# EAGLE schematic BatteryBoardV2B (EAGLE 8.2.2)
EquiSat Battery Charging

## Sheet 1 of 6: Data and I/O
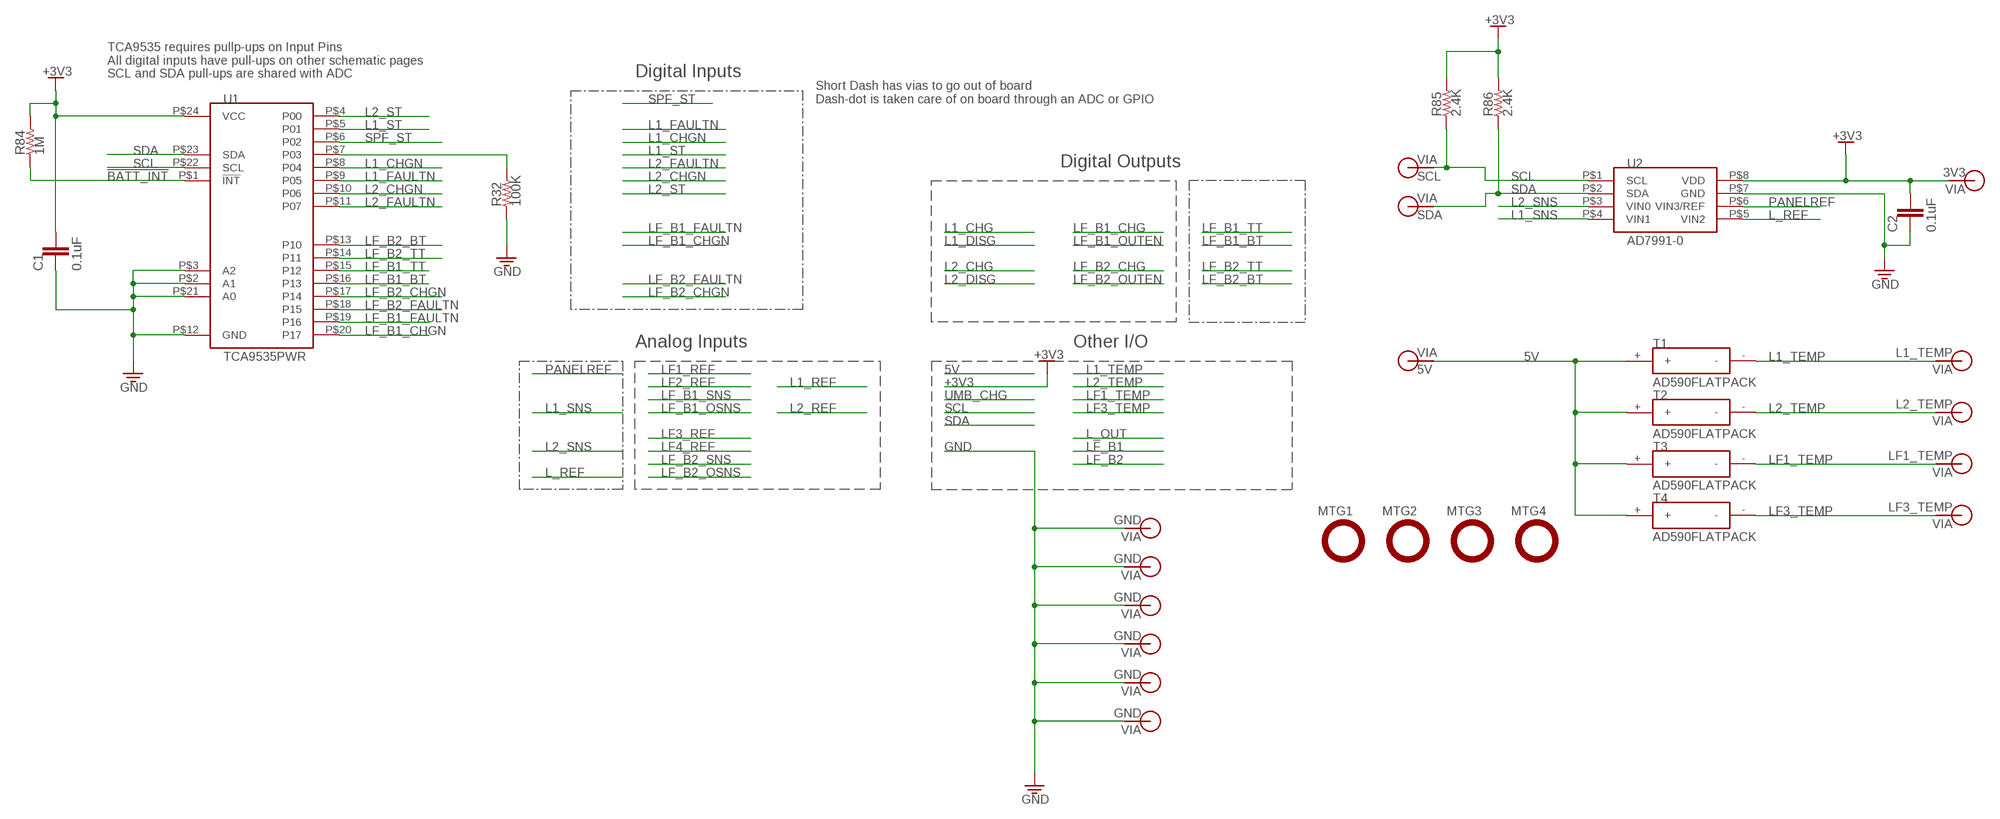
[diagram p0: schematic, sheet 1]

### Parts
C1  0.1uF  CAP0805  [0805]
C2  0.1uF  CAP0805  [0805]
MTG1  MTG-NPTH-#2-CLOSE  [#2-CLOSE-NPTH]
MTG2  MTG-NPTH-#2-CLOSE  [#2-CLOSE-NPTH]
MTG3  MTG-NPTH-#2-CLOSE  [#2-CLOSE-NPTH]
MTG4  MTG-NPTH-#2-CLOSE  [#2-CLOSE-NPTH]
R32  100K  RES0805  [0805]
R84  1M  RES0805  [0805]
R85  2.4K  RES0805  [0805]
R86  2.4K  RES0805  [0805]
T1  AD590FLATPACK  [FLATPACK]
T2  AD590FLATPACK  [FLATPACK]
T3  AD590FLATPACK  [FLATPACK]
T4  AD590FLATPACK  [FLATPACK]
U1  TCA9535PWR  [TSSOP-24]
U2  AD7991-0  [SOT-23-8]
V1  GND  VIA-120MIL  [VIA-120MIL]
V2  GND  VIA-120MIL  [VIA-120MIL]
V3  GND  VIA60MIL-SQ  [VIA-60MIL-SQ]
V4  GND  VIA-120MIL  [VIA-120MIL]
V5  SCL  VIA-60MIL  [VIA-60MIL]
V6  SDA  VIA-60MIL  [VIA-60MIL]
V7  5V  VIA-60MIL  [VIA-60MIL]
V8  L1_TEMP  VIA-60MIL  [VIA-60MIL]
V9  L2_TEMP  VIA-60MIL  [VIA-60MIL]
V10  LF1_TEMP  VIA-60MIL  [VIA-60MIL]
V11  LF3_TEMP  VIA-60MIL  [VIA-60MIL]
V12  3V3  VIA-60MIL  [VIA-60MIL]
V28  GND  VIA60MIL-SQ  [VIA-60MIL-SQ]
V36  GND  VIA60MIL-SQ  [VIA-60MIL-SQ]

### Nets
5V [Analog]: T1.+ T2.+ T3.+ T4.+ V7.P$1
!BATT_INT!: R84.1 U1.P$1(!INT!)
+3V3 [3V3]: C1.1 C2.1 R84.2 R85.2 R86.2 U1.P$24(VCC) U2.P$8(VDD) V12.P$1 ; also sheet 2,3,5,6
GND: C1.2 C2.2 R32.1 U1.P$2(A1) U1.P$3(A2) U1.P$12(GND) U1.P$21(A0) U2.P$7(GND) V1.P$1 V2.P$1 V3.P$1 V4.P$1 V28.P$1 V36.P$1 ; also sheet 2,3,4,5,6
L1_CHGN [Digital]: U1.P$8(P04) ; also sheet 3
L1_FAULTN [Digital]: U1.P$9(P05) ; also sheet 3
L1_SNS [Analog]: U2.P$4(VIN1) ; also sheet 3
L1_ST [Digital]: U1.P$5(P01) ; also sheet 4
L1_TEMP [Analog]: T1.- V8.P$1
L2_CHGN [Analog]: U1.P$10(P06) ; also sheet 3
L2_FAULTN [Digital]: U1.P$11(P07) ; also sheet 3
L2_SNS [Analog]: U2.P$3(VIN0) ; also sheet 3
L2_ST [Digital]: U1.P$4(P00) ; also sheet 4
L2_TEMP [Analog]: T2.- V9.P$1
L_REF [Analog]: U2.P$5(VIN2) ; also sheet 4
LF1_TEMP [Analog]: T3.- V10.P$1
LF3_TEMP [Analog]: T4.- V11.P$1
LF_B1_BT [Digital]: U1.P$16(P13)
LF_B1_CHGN [Digital]: U1.P$20(P17) ; also sheet 5
LF_B1_FAULTN [Digital]: U1.P$19(P16) ; also sheet 5
LF_B1_TT [Digital]: U1.P$15(P12)
LF_B2_BT [Digital]: U1.P$13(P10)
LF_B2_CHGN [Digital]: U1.P$17(P14) ; also sheet 6
LF_B2_FAULTN [Digital]: U1.P$18(P15) ; also sheet 6
LF_B2_TT [Digital]: U1.P$14(P11)
N$15: R32.2 U1.P$7(P03)
PANELREF [Analog]: U2.P$6(VIN3/REF) ; also sheet 2
SCL [I2C]: R85.1 U1.P$22(SCL) U2.P$1(SCL) V5.P$1
SDA [I2C]: R86.1 U1.P$23(SDA) U2.P$2(SDA) V6.P$1
SPF_ST [Digital]: U1.P$6(P02) ; also sheet 2

### Notes on the sheet
- TCA9535 requires pullp-ups on Input Pins
  All digital inputs have pull-ups on other schematic pages
- SCL and SDA pull-ups are shared with ADC | Digital Inputs
- Short Dash has vias to go out of board
  Dash-dot is taken care of on board through an ADC or GPIO
- Digital Outputs
- Analog Inputs | Other I/O

## Sheet 2 of 6: Solar Panel Front End
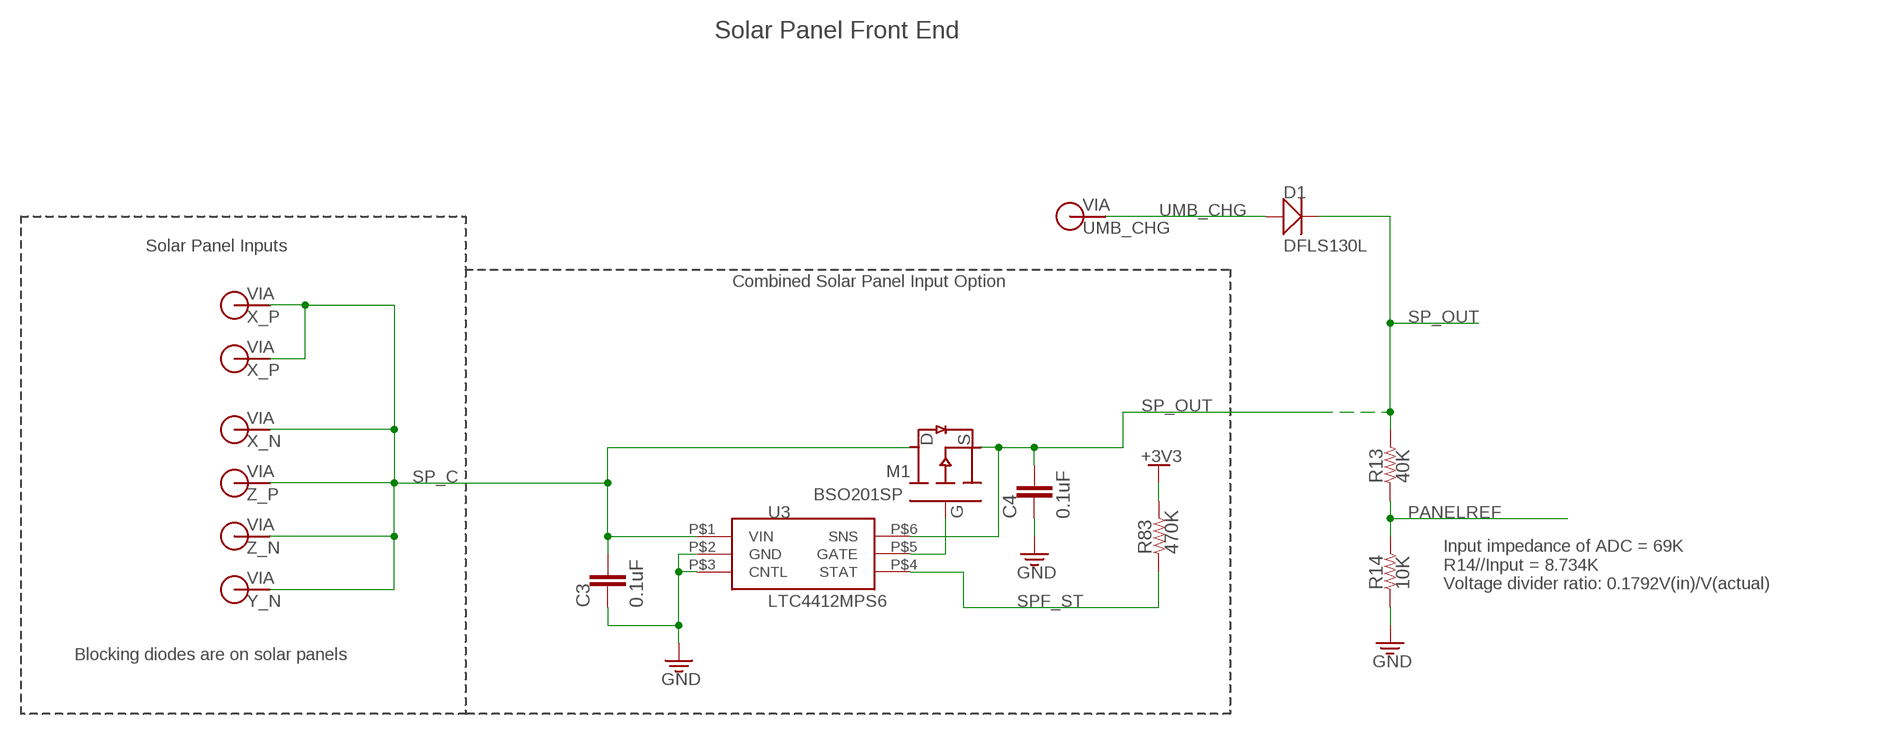
[diagram p1: schematic, sheet 2]

### Parts
C3  0.1uF  CAP0805  [0805]
C4  0.1uF  CAP0805  [0805]
D1  DFLS130L  [PWRDI-123]
M1  BSO201SP  [SO-8]
R13  40K  RES0805  [0805]
R14  10K  RES0805  [0805]
R83  470K  RES0805  [0805]
U3  LTC4412MPS6  LTC4412  [TSOT23-6]
V13  X_P  VIA-60MIL  [VIA-60MIL]
V14  X_P  VIA60MIL-SQ  [VIA-60MIL-SQ]
V15  X_N  VIA-60MIL  [VIA-60MIL]
V16  Z_P  VIA-60MIL  [VIA-60MIL]
V17  Z_N  VIA-60MIL  [VIA-60MIL]
V18  Y_N  VIA-60MIL  [VIA-60MIL]
V19  UMB_CHG  VIA-60MIL  [VIA-60MIL]

### Nets
+3V3 [3V3]: R83.2 ; also sheet 1,3,5,6
GND: C3.2 C4.2 R14.1 U3.P$2(GND) U3.P$3(CNTL) ; also sheet 1,3,4,5,6
N$1: M1.P$4(G) U3.P$5(GATE)
PANELREF [Analog]: R13.1 R14.2 ; also sheet 1
SP_C [SolarPower]: C3.1 M1.P$5(D) M1.P$6(D) M1.P$7(D) M1.P$8(D) U3.P$1(VIN) V13.P$1 V14.P$1 V15.P$1 V16.P$1 V17.P$1 V18.P$1
SP_OUT [SolarPower]: C4.1 D1.C M1.P$1(S) M1.P$2(S) M1.P$3(S) R13.2 U3.P$6(SNS) ; also sheet 3,4,5,6
SPF_ST [Digital]: R83.1 U3.P$4(STAT) ; also sheet 1
UMB_CHG [SolarPower]: D1.A V19.P$1 ; also sheet 1

### Notes on the sheet
- Solar Panel Front End
- Solar Panel Inputs
- Combined Solar Panel Input Option
- Input impedance of ADC = 69K
  R14//Input = 8.734K
  Voltage divider ratio: 0.1792V(in)/V(actual)
- Blocking diodes are on solar panels

## Sheet 3 of 6: Li-Ion Charging
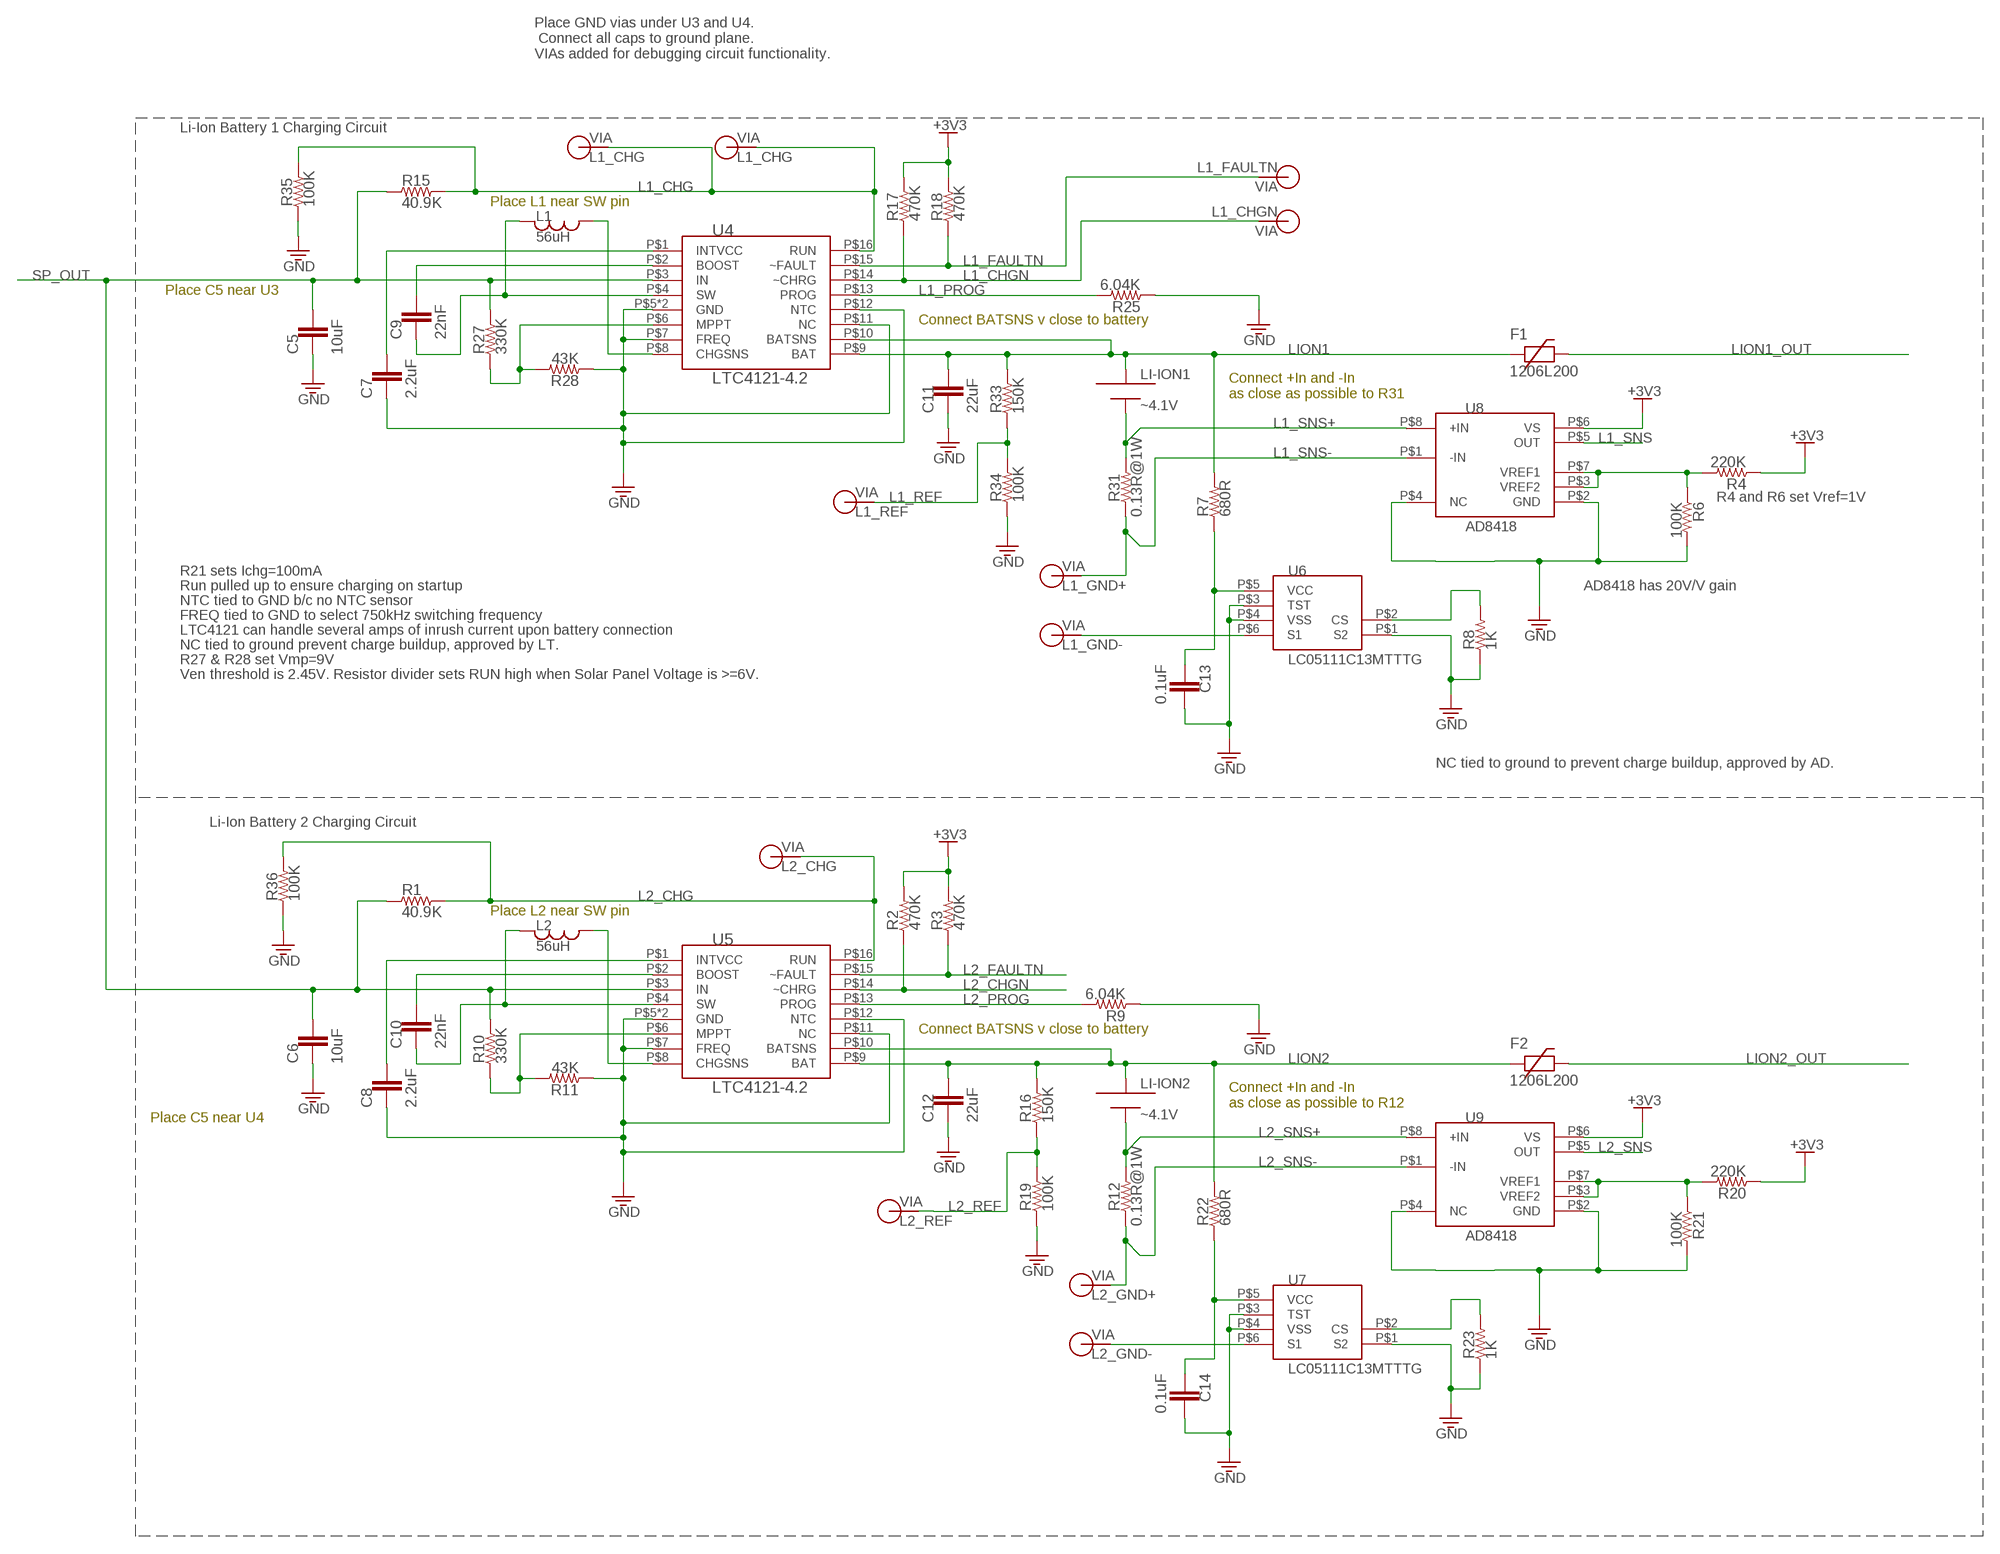
[diagram p2: schematic, sheet 3]

### Parts
C5  10uF  CAP0805  [0805]
C6  10uF  CAP0805  [0805]
C7  2.2uF  CAP0805  [0805]
C8  2.2uF  CAP0805  [0805]
C9  22nF  CAP0805  [0805]
C10  22nF  CAP0805  [0805]
C11  22uF  CAP0805  [0805]
C12  22uF  CAP0805  [0805]
C13  0.1uF  CAP0805  [0805]
C14  0.1uF  CAP0805  [0805]
F1  1206L200  PTCFUSE1206  [1206]
F2  1206L200  PTCFUSE1206  [1206]
L1  56uH  IND1812  [1812]
L2  56uH  IND1812  [1812]
LI-ION1  ~4.1V  LI-ION  [EQUISAT-BATTERY-VA]
LI-ION2  ~4.1V  LI-ION  [EQUISAT-BATTERY-VA]
R1  40.9K  RES0805  [0805]
R2  470K  RES0805  [0805]
R3  470K  RES0805  [0805]
R4  220K  RES0805  [0805]
R6  100K  RES0805  [0805]
R7  680R  RES0805  [0805]
R8  1K  RES0805  [0805]
R9  6.04K  RES0805  [0805]
R10  330K  RES0805  [0805]
R11  43K  RES0805  [0805]
R12  0.13R@1W  RES1210  [1210]
R15  40.9K  RES0805  [0805]
R16  150K  RES0805  [0805]
R17  470K  RES0805  [0805]
R18  470K  RES0805  [0805]
R19  100K  RES0805  [0805]
R20  220K  RES0805  [0805]
R21  100K  RES0805  [0805]
R22  680R  RES0805  [0805]
R23  1K  RES0805  [0805]
R25  6.04K  RES0805  [0805]
R27  330K  RES0805  [0805]
R28  43K  RES0805  [0805]
R31  0.13R@1W  RES1210  [1210]
R33  150K  RES0805  [0805]
R34  100K  RES0805  [0805]
R35  100K  RES0805  [0805]
R36  100K  RES0805  [0805]
U4  LTC4121-4.2  [QFN-16-PAD]
U5  LTC4121-4.2  [QFN-16-PAD]
U6  LC05111C13MTTTG  [WDFN6]
U7  LC05111C13MTTTG  [WDFN6]
U8  AD8418  [MSOP-8]
U9  AD8418  [MSOP-8]
V20  L1_CHG  VIA-60MIL  [VIA-60MIL]
V21  L1_REF  VIA-60MIL  [VIA-60MIL]
V22  L1_GND+  VIA-60MIL  [VIA-60MIL]
V23  L1_GND-  VIA-60MIL  [VIA-60MIL]
V24  L2_GND+  VIA-60MIL  [VIA-60MIL]
V25  L2_GND-  VIA-60MIL  [VIA-60MIL]
V26  L1_FAULTN  VIA60MIL-SQ  [VIA-60MIL-SQ]
V27  L1_CHGN  VIA60MIL-SQ  [VIA-60MIL-SQ]
V31  L2_REF  VIA-60MIL  [VIA-60MIL]
V33  L2_CHG  VIA-60MIL  [VIA-60MIL]
V48  L1_CHG  VIA60MIL-SQ  [VIA-60MIL-SQ]

### Nets
+3V3 [3V3]: R2.2 R3.2 R4.1 R17.2 R18.2 R20.1 U8.P$6(VS) U9.P$6(VS) ; also sheet 1,2,5,6
GND: C5.2 C6.2 C7.2 C8.2 C11.2 C12.2 C13.1 C14.1 R6.2 R8.1 R9.1 R11.1 R19.1 R21.2 R23.1 R25.1 R28.1 R34.1 R35.1 R36.1 U4.P$5(GND) U4.P$7(FREQ) U4.P$11(NC) U4.P$12(NTC) U4.P$17(GND) U5.P$5(GND) U5.P$7(FREQ) U5.P$11(NC) U5.P$12(NTC) U5.P$17(GND) U6.P$1(S2) U6.P$3(TST) U6.P$4(VSS) U7.P$1(S2) U7.P$3(TST) U7.P$4(VSS) U8.P$2(GND) U8.P$4(NC) U9.P$2(GND) U9.P$4(NC) ; also sheet 1,2,4,5,6
L1_CHG [Digital]: R15.2 R35.2 U4.P$16(RUN) V20.P$1 V48.P$1 ; also sheet 1
L1_CHGN [Digital]: R17.1 U4.P$14(~CHRG) V27.P$1 ; also sheet 1
L1_FAULTN [Digital]: R18.1 U4.P$15(~FAULT) V26.P$1 ; also sheet 1
L1_PROG: R25.2 U4.P$13(PROG)
L1_REF [Analog]: R33.1 R34.2 V21.P$1 ; also sheet 1
L1_SNS [Analog]: U8.P$5(OUT) ; also sheet 1
L1_SNS+: LI-ION1.MINUS R31.P$2 U8.P$8(+IN)
L1_SNS-: R31.P$1 U8.P$1(-IN) V22.P$1
L2_CHG [Digital]: R1.2 R36.2 U5.P$16(RUN) V33.P$1 ; also sheet 1
L2_CHGN [Analog]: R2.1 U5.P$14(~CHRG) ; also sheet 1
L2_FAULTN [Digital]: R3.1 U5.P$15(~FAULT) ; also sheet 1
L2_PROG: R9.2 U5.P$13(PROG)
L2_REF [Analog]: R16.1 R19.2 V31.P$1 ; also sheet 1
L2_SNS [Analog]: U9.P$5(OUT) ; also sheet 1
L2_SNS+: LI-ION2.MINUS R12.P$2 U9.P$8(+IN)
L2_SNS-: R12.P$1 U9.P$1(-IN) V24.P$1
LION1 [Li-ion]: C11.1 F1.1 LI-ION1.PLUS R7.2 R33.2 U4.P$9(BAT) U4.P$10(BATSNS)
LION1_OUT [Li-ion]: F1.2 ; also sheet 4
LION2 [Li-ion]: C12.1 F2.1 LI-ION2.PLUS R16.2 R22.2 U5.P$9(BAT) U5.P$10(BATSNS)
LION2_OUT [Li-ion]: F2.2 ; also sheet 4
N$6: C10.2 L2.P$1 U5.P$4(SW)
N$8 [SolarPower]: C9.2 L1.P$1 U4.P$4(SW)
N$9: C9.1 U4.P$2(BOOST)
N$13: C7.1 U4.P$1(INTVCC)
N$14: C10.1 U5.P$2(BOOST)
N$16: U6.P$6(S1) V23.P$1
N$17: C8.1 U5.P$1(INTVCC)
N$18 [SolarPower]: L1.P$2 U4.P$8(CHGSNS)
N$22: R27.1 R28.2 U4.P$6(MPPT)
N$34: R4.2 R6.1 U8.P$3(VREF2) U8.P$7(VREF1)
N$44: C13.2 R7.1 U6.P$5(VCC)
N$45: R8.2 U6.P$2(CS)
N$48: R10.1 R11.2 U5.P$6(MPPT)
N$49: L2.P$2 U5.P$8(CHGSNS)
N$51: R20.2 R21.1 U9.P$3(VREF2) U9.P$7(VREF1)
N$52: U7.P$6(S1) V25.P$1
N$53: R23.2 U7.P$2(CS)
N$54: C14.2 R22.1 U7.P$5(VCC)
SP_OUT [SolarPower]: C5.1 C6.1 R1.1 R10.2 R15.1 R27.2 U4.P$3(IN) U5.P$3(IN) ; also sheet 2,4,5,6

### Notes on the sheet
- Place GND vias under U3 and U4.
   Connect all caps to ground plane.
  VIAs added for debugging circuit functionality.
- Li-Ion Battery 1 Charging Circuit
- Place L1 near SW pin
- Place C5 near U3
- Connect BATSNS v close to battery
- Connect +In and -In
  as close as possible to R31
- R4 and R6 set Vref=1V
- R21 sets Ichg=100mA
- Run pulled up to ensure charging on startup | AD8418 has 20V/V gain
- NTC tied to GND b/c no NTC sensor
- FREQ tied to GND to select 750kHz switching frequency
- LTC4121 can handle several amps of inrush current upon battery connection
- NC tied to ground prevent charge buildup, approved by LT.
- R27 & R28 set Vmp=9V
- Ven threshold is 2.45V. Resistor divider sets RUN high when Solar Panel Voltage is >=6V.
- NC tied to ground to prevent charge buildup, approved by AD.
- Li-Ion Battery 2 Charging Circuit
- Place L2 near SW pin
- Connect BATSNS v close to battery
- Connect +In and -In
  as close as possible to R12
- Place C5 near U4

## Sheet 4 of 6: Li-Ion Diode Or'ing
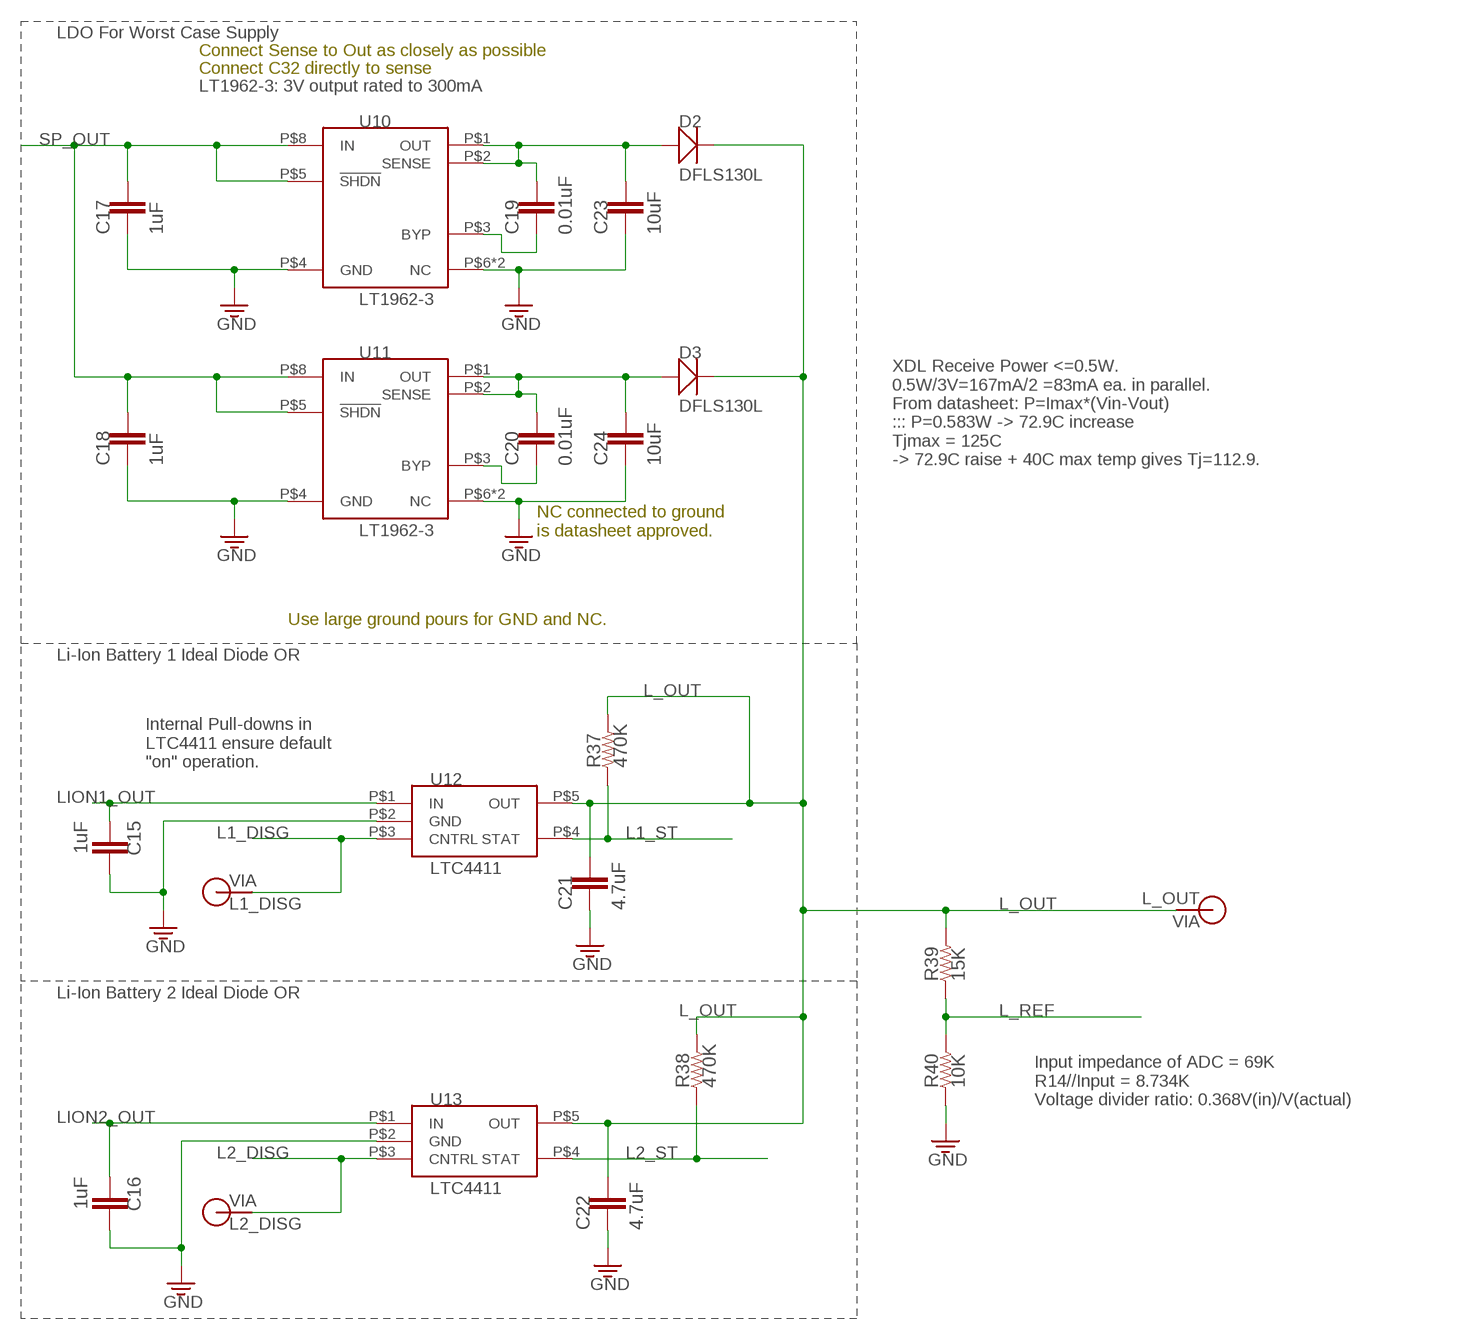
[diagram p3: schematic, sheet 4]

### Parts
C15  1uF  CAP0805  [0805]
C16  1uF  CAP0805  [0805]
C17  1uF  CAP0805  [0805]
C18  1uF  CAP0805  [0805]
C19  0.01uF  CAP0805  [0805]
C20  0.01uF  CAP0805  [0805]
C21  4.7uF  CAP0805  [0805]
C22  4.7uF  CAP0805  [0805]
C23  10uF  CAP0805  [0805]
C24  10uF  CAP0805  [0805]
D2  DFLS130L  [PWRDI-123]
D3  DFLS130L  [PWRDI-123]
R37  470K  RES0805  [0805]
R38  470K  RES0805  [0805]
R39  15K  RES0805  [0805]
R40  10K  RES0805  [0805]
U10  LT1962-3  [MSOP-8]
U11  LT1962-3  [MSOP-8]
U12  LTC4411  [TSOT23-5]
U13  LTC4411  [TSOT23-5]
V29  L1_DISG  VIA-60MIL  [VIA-60MIL]
V30  L2_DISG  VIA-60MIL  [VIA-60MIL]
V34  L_OUT  VIA-120MIL  [VIA-120MIL]

### Nets
GND: C15.1 C16.1 C17.2 C18.2 C21.2 C22.2 C23.2 C24.2 R40.1 U10.P$4(GND) U10.P$6(NC) U10.P$7(NC) U11.P$4(GND) U11.P$6(NC) U11.P$7(NC) U12.P$2(GND) U13.P$2(GND) ; also sheet 1,2,3,5,6
L1_DISG [Digital]: U12.P$3(CNTRL) V29.P$1 ; also sheet 1
L1_ST [Digital]: R37.1 U12.P$4(STAT) ; also sheet 1
L2_DISG [Digital]: U13.P$3(CNTRL) V30.P$1 ; also sheet 1
L2_ST [Digital]: R38.1 U13.P$4(STAT) ; also sheet 1
L_OUT: C21.1 C22.1 D2.C D3.C R37.2 R38.2 R39.2 U12.P$5(OUT) U13.P$5(OUT) V34.P$1 ; also sheet 1
L_REF [Analog]: R39.1 R40.2 ; also sheet 1
LION1_OUT [Li-ion]: C15.2 U12.P$1(IN) ; also sheet 3
LION2_OUT [Li-ion]: C16.2 U13.P$1(IN) ; also sheet 3
N$2: C20.1 C24.1 D3.A U11.P$1(OUT) U11.P$2(SENSE)
N$3: C19.1 C23.1 D2.A U10.P$1(OUT) U10.P$2(SENSE)
N$4: C20.2 U11.P$3(BYP)
N$5: C19.2 U10.P$3(BYP)
SP_OUT [SolarPower]: C17.1 C18.1 U10.P$5(!SHDN!) U10.P$8(IN) U11.P$5(!SHDN!) U11.P$8(IN) ; also sheet 2,3,5,6

### Notes on the sheet
- LDO For Worst Case Supply
- Connect Sense to Out as closely as possible
- Connect C32 directly to sense
- LT1962-3: 3V output rated to 300mA
- XDL Receive Power <=0.5W.
  0.5W/3V=167mA/2 =83mA ea. in parallel.
  From datasheet: P=Imax*(Vin-Vout)
  ::: P=0.583W -> 72.9C increase
  Tjmax = 125C
  -> 72.9C raise + 40C max temp gives Tj=112.9.
- NC connected to ground
  is datasheet approved.
- Use large ground pours for GND and NC.
- Li-Ion Battery 1 Ideal Diode OR
- Internal Pull-downs in
  LTC4411 ensure default
  "on" operation.
- Li-Ion Battery 2 Ideal Diode OR
- Input impedance of ADC = 69K
  R14//Input = 8.734K
  Voltage divider ratio: 0.368V(in)/V(actual)

## Sheet 5 of 6: LiFePO4 Bank 1 Charging
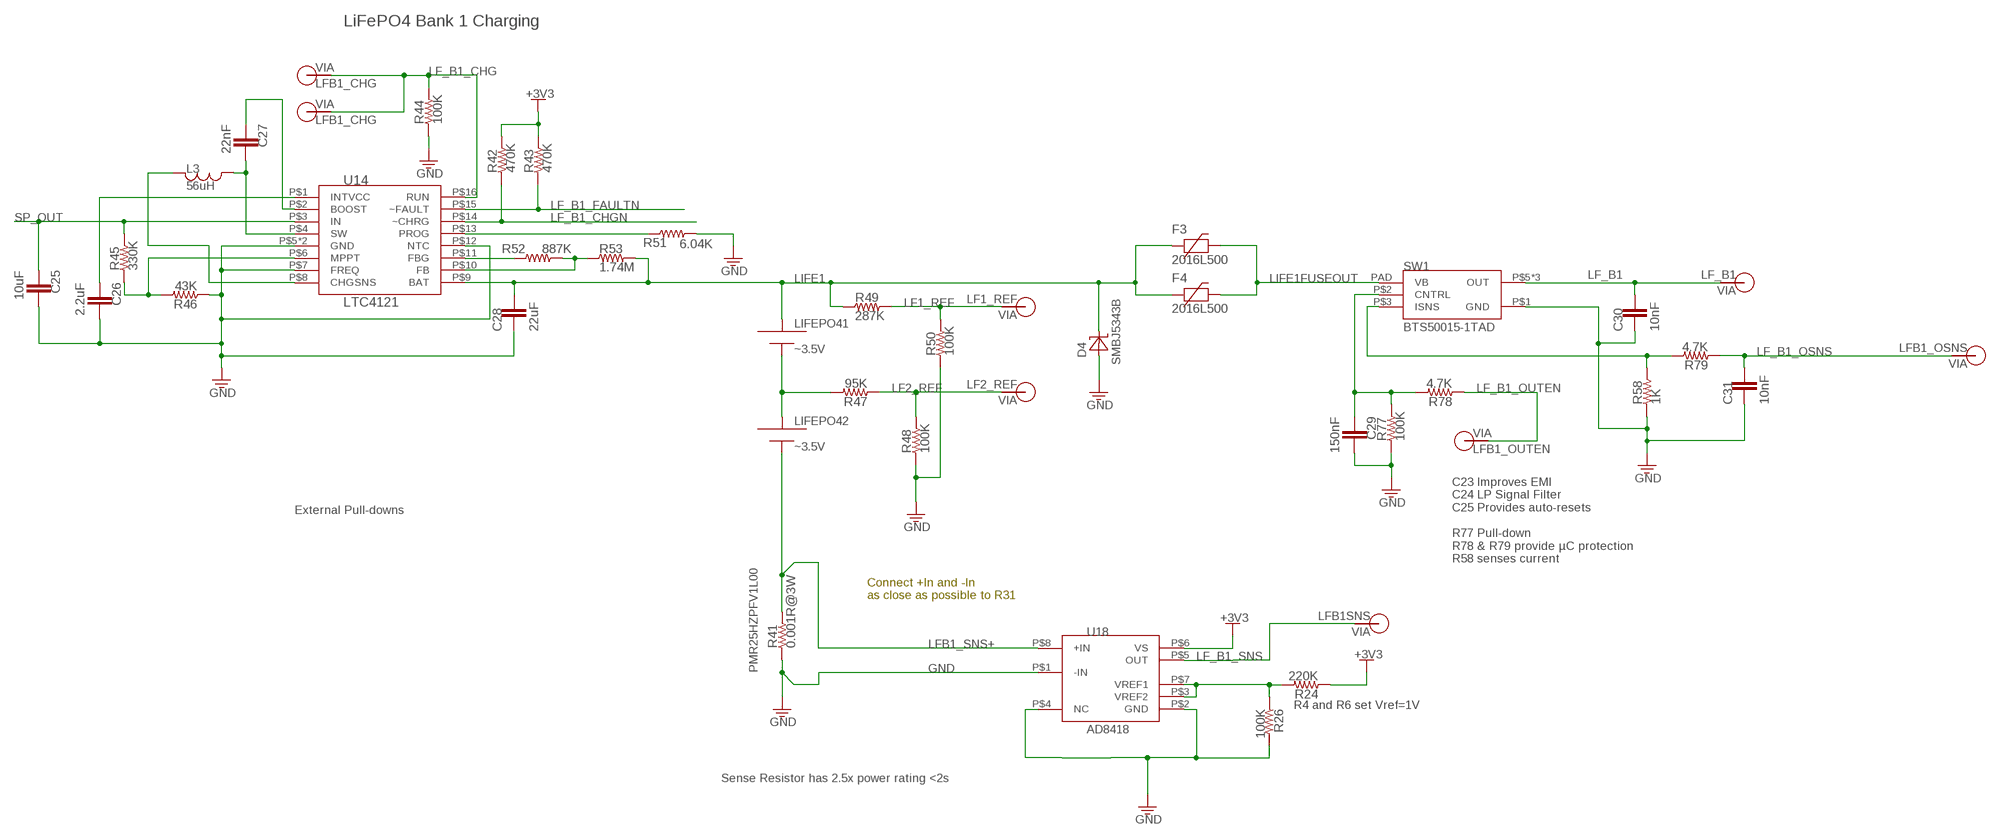
[diagram p4: schematic, sheet 5]

### Parts
C25  10uF  CAP0805  [0805]
C26  2.2uF  CAP0805  [0805]
C27  22nF  CAP0805  [0805]
C28  22uF  CAP0805  [0805]
C29  150nF  CAP0805  [0805]
C30  10nF  CAP0805  [0805]
C31  10nF  CAP0805  [0805]
D4  SMBJ5343B  [DO214AA]
F3  2016L500  [2016]
F4  2016L500  [2016]
L3  56uH  IND1812  [1812]
LIFEPO41  ~3.5V  LIFEPO4VA  [EQUISAT-BATTERY-VA]
LIFEPO42  ~3.5V  LIFEPO4VB  [EQUISAT-BATTERY-VB]
R24  220K  RES0805  [0805]
R26  100K  RES0805  [0805]
R41  0.001R@3W  RES1210  [1210]
R42  470K  RES0805  [0805]
R43  470K  RES0805  [0805]
R44  100K  RES0805  [0805]
R45  330K  RES0805  [0805]
R46  43K  RES0805  [0805]
R47  95K  RES0805  [0805]
R48  100K  RES0805  [0805]
R49  287K  RES0805  [0805]
R50  100K  RES0805  [0805]
R51  6.04K  RES0805  [0805]
R52  887K  RES0805  [0805]
R53  1.74M  RES0805  [0805]
R58  1K  RES0805  [0805]
R77  100K  RES0805  [0805]
R78  4.7K  RES0805  [0805]
R79  4.7K  RES0805  [0805]
SW1  BTS50015-1TAD  [TO-263-7-8]
U14  LTC4121  [QFN-16-PAD]
U18  AD8418  [MSOP-8]
V32  LFB1_CHG  VIA60MIL-SQ  [VIA-60MIL-SQ]
V35  LFB1_CHG  VIA-60MIL  [VIA-60MIL]
V40  LFB1SNS  VIA-60MIL  [VIA-60MIL]
V41  LF1_REF  VIA-60MIL  [VIA-60MIL]
V42  LF2_REF  VIA-60MIL  [VIA-60MIL]
V43  LFB1_OUTEN  VIA-60MIL  [VIA-60MIL]
V45  LF_B1  VIA-120MIL  [VIA-120MIL]
V46  LFB1_OSNS  VIA-60MIL  [VIA-60MIL]

### Nets
+3V3 [3V3]: R24.1 R42.2 R43.2 U18.P$6(VS) ; also sheet 1,2,3,6
GND: C25.1 C26.1 C28.2 C29.1 C30.2 C31.2 D4.A R26.2 R41.P$1 R44.1 R46.1 R48.1 R50.1 R51.2 R58.1 R77.1 SW1.P$1(GND) U14.P$5(GND) U14.P$7(FREQ) U14.P$12(NTC) U14.P$17(GND) U18.P$1(-IN) U18.P$2(GND) U18.P$4(NC) ; also sheet 1,2,3,4,6
LF1_REF [Analog]: R49.2 R50.2 V41.P$1 ; also sheet 1
LF2_REF [Analog]: R47.1 R48.2 V42.P$1 ; also sheet 1
LF_B1: C30.1 SW1.P$5(OUT) SW1.P$6(OUT) SW1.P$7(OUT) V45.P$1 ; also sheet 1
LF_B1_CHG [Digital]: R44.2 U14.P$16(RUN) V32.P$1 V35.P$1 ; also sheet 1
LF_B1_CHGN [Digital]: R42.1 U14.P$14(~CHRG) ; also sheet 1
LF_B1_FAULTN [Digital]: R43.1 U14.P$15(~FAULT) ; also sheet 1
LF_B1_OSNS [Analog]: C31.1 R79.1 V46.P$1 ; also sheet 1
LF_B1_OUTEN [Digital]: R78.1 V43.P$1 ; also sheet 1
LF_B1_SNS [Analog]: U18.P$5(OUT) V40.P$1 ; also sheet 1
LFB1_SNS+: LIFEPO42.MINUS R41.P$2 U18.P$8(+IN)
LIFE1: C28.1 D4.C F3.P$1 F4.P$1 LIFEPO41.PLUS R49.1 R53.2 U14.P$9(BAT)
LIFE1FUSEOUT: F3.P$2 F4.P$2 SW1.PAD(VB)
LIFE2: LIFEPO41.MINUS LIFEPO42.PLUS R47.2
N$7: R51.1 U14.P$13(PROG)
N$11: R24.2 R26.1 U18.P$3(VREF2) U18.P$7(VREF1)
N$26: R52.1 U14.P$11(FBG)
N$27: R45.1 R46.2 U14.P$6(MPPT)
N$28: R52.2 R53.1 U14.P$10(FB)
N$29: C26.2 U14.P$1(INTVCC)
N$30: C27.1 L3.P$2 U14.P$4(SW)
N$31: C27.2 U14.P$2(BOOST)
N$32: L3.P$1 U14.P$8(CHGSNS)
N$68: C29.2 R77.2 R78.2 SW1.P$2(CNTRL)
N$686: R58.2 R79.2 SW1.P$3(ISNS)
SP_OUT [SolarPower]: C25.2 R45.2 U14.P$3(IN) ; also sheet 2,3,4,6

### Notes on the sheet
- LiFePO4 Bank 1 Charging
- External Pull-downs
- C23 Improves EMI
  C24 LP Signal Filter
  C25 Provides auto-resets
  
  R77 Pull-down
  R78 & R79 provide µC protection
  R58 senses current
- Connect +In and -In
  as close as possible to R31
- PMR25HZPFV1L00
- R4 and R6 set Vref=1V
- Sense Resistor has 2.5x power rating <2s

## Sheet 6 of 6: LiFePO4 Bank 2 Charging
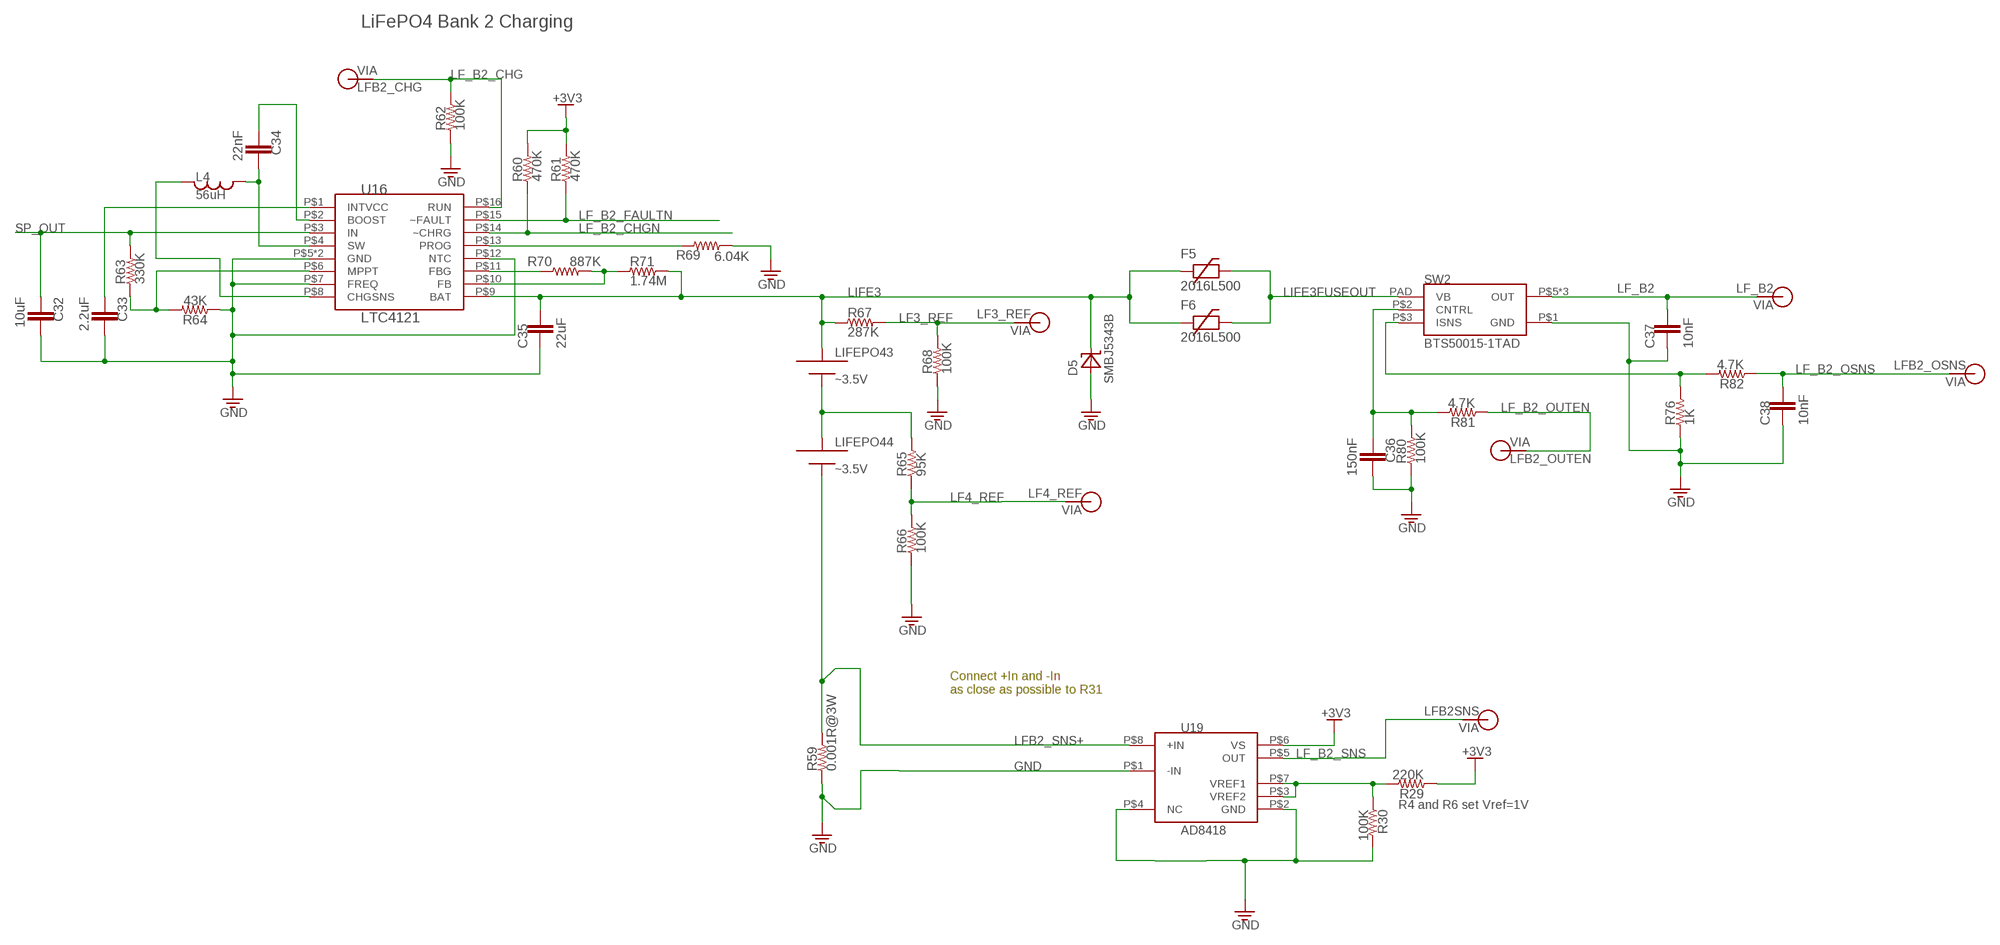
[diagram p5: schematic, sheet 6]

### Parts
C32  10uF  CAP0805  [0805]
C33  2.2uF  CAP0805  [0805]
C34  22nF  CAP0805  [0805]
C35  22uF  CAP0805  [0805]
C36  150nF  CAP0805  [0805]
C37  10nF  CAP0805  [0805]
C38  10nF  CAP0805  [0805]
D5  SMBJ5343B  [DO214AA]
F5  2016L500  [2016]
F6  2016L500  [2016]
L4  56uH  IND1812  [1812]
LIFEPO43  ~3.5V  LIFEPO4VA  [EQUISAT-BATTERY-VA]
LIFEPO44  ~3.5V  LIFEPO4VB  [EQUISAT-BATTERY-VB]
R29  220K  RES0805  [0805]
R30  100K  RES0805  [0805]
R59  0.001R@3W  RES1210  [1210]
R60  470K  RES0805  [0805]
R61  470K  RES0805  [0805]
R62  100K  RES0805  [0805]
R63  330K  RES0805  [0805]
R64  43K  RES0805  [0805]
R65  95K  RES0805  [0805]
R66  100K  RES0805  [0805]
R67  287K  RES0805  [0805]
R68  100K  RES0805  [0805]
R69  6.04K  RES0805  [0805]
R70  887K  RES0805  [0805]
R71  1.74M  RES0805  [0805]
R76  1K  RES0805  [0805]
R80  100K  RES0805  [0805]
R81  4.7K  RES0805  [0805]
R82  4.7K  RES0805  [0805]
SW2  BTS50015-1TAD  [TO-263-7-8]
U16  LTC4121  [QFN-16-PAD]
U19  AD8418  [MSOP-8]
V44  LFB2SNS  VIA-60MIL  [VIA-60MIL]
V47  LFB2_CHG  VIA-60MIL  [VIA-60MIL]
V49  LF3_REF  VIA-60MIL  [VIA-60MIL]
V50  LF4_REF  VIA-60MIL  [VIA-60MIL]
V51  LFB2_OUTEN  VIA-60MIL  [VIA-60MIL]
V53  LF_B2  VIA-120MIL  [VIA-120MIL]
V99  LFB2_OSNS  VIA-60MIL  [VIA-60MIL]

### Nets
+3V3 [3V3]: R29.1 R60.2 R61.2 U19.P$6(VS) ; also sheet 1,2,3,5
GND: C32.1 C33.1 C35.2 C36.1 C37.2 C38.2 D5.A R30.2 R59.P$1 R62.1 R64.1 R66.1 R68.1 R69.2 R76.1 R80.1 SW2.P$1(GND) U16.P$5(GND) U16.P$7(FREQ) U16.P$12(NTC) U16.P$17(GND) U19.P$1(-IN) U19.P$2(GND) U19.P$4(NC) ; also sheet 1,2,3,4,5
LF3_REF [Analog]: R67.2 R68.2 V49.P$1 ; also sheet 1
LF4_REF [Analog]: R65.1 R66.2 V50.P$1 ; also sheet 1
LF_B2: C37.1 SW2.P$5(OUT) SW2.P$6(OUT) SW2.P$7(OUT) V53.P$1 ; also sheet 1
LF_B2_CHG [Digital]: R62.2 U16.P$16(RUN) V47.P$1 ; also sheet 1
LF_B2_CHGN [Digital]: R60.1 U16.P$14(~CHRG) ; also sheet 1
LF_B2_FAULTN [Digital]: R61.1 U16.P$15(~FAULT) ; also sheet 1
LF_B2_OSNS [Analog]: C38.1 R82.1 V99.P$1 ; also sheet 1
LF_B2_OUTEN [Digital]: R81.1 V51.P$1 ; also sheet 1
LF_B2_SNS [Analog]: U19.P$5(OUT) V44.P$1 ; also sheet 1
LFB2_SNS+: LIFEPO44.MINUS R59.P$2 U19.P$8(+IN)
LIFE3: C35.1 D5.C F5.P$1 F6.P$1 LIFEPO43.PLUS R67.1 R71.2 U16.P$9(BAT)
LIFE3FUSEOUT: F5.P$2 F6.P$2 SW2.PAD(VB)
LIFE4: LIFEPO43.MINUS LIFEPO44.PLUS R65.2
N$10: R29.2 R30.1 U19.P$3(VREF2) U19.P$7(VREF1)
N$33: R63.1 R64.2 U16.P$6(MPPT)
N$35: R69.1 U16.P$13(PROG)
N$36: R70.1 U16.P$11(FBG)
N$37: R70.2 R71.1 U16.P$10(FB)
N$38: C33.2 U16.P$1(INTVCC)
N$39: C34.1 L4.P$2 U16.P$4(SW)
N$40: C34.2 U16.P$2(BOOST)
N$41: L4.P$1 U16.P$8(CHGSNS)
N$451: R76.2 R82.2 SW2.P$3(ISNS)
N$1356: C36.2 R80.2 R81.2 SW2.P$2(CNTRL)
SP_OUT [SolarPower]: C32.2 R63.2 U16.P$3(IN) ; also sheet 2,3,4,5

### Notes on the sheet
- LiFePO4 Bank 2 Charging
- Connect +In and -In
  as close as possible to R31
- R4 and R6 set Vref=1V

## Library data of the parts
C1-C38 = BrownSpaceEngineering:CAP: Capacitor
D1-D3 = BrownSpaceEngineering:DFLS130L
D4 D5 = BattBoard:SMBJ5343B
F1 F2 = BrownSpaceEngineering:PTCFUSE: PTC Fuse
F3-F6 = BrownSpaceEngineering:2016L
L1-L4 = BrownSpaceEngineering:IND
LI-ION1 LI-ION2 = BrownSpaceEngineering:LI-ION
LIFEPO41-LIFEPO44 = BrownSpaceEngineering:LIFEPO4
M1 = BrownSpaceEngineering:BSO201SP
MTG1-MTG4 = BrownSpaceEngineering:MTG-NPTH
R1-R4 R6-R53 R58-R71 R76-R86 = BrownSpaceEngineering:RES
SW1 SW2 = BrownSpaceEngineering:BTS50015-1TAD
T1-T4 = BrownSpaceEngineering:AD590: Analog, 2-pin Temperature Transducer
U1 = BrownSpaceEngineering:TCA9535
U2 = BrownSpaceEngineering:AD7991: 4-channel, 12-bit, I2C ADC
U3 = BrownSpaceEngineering:LTC4412
U4 U5 = BrownSpaceEngineering:LTC4121-4.2
U6 U7 = BrownSpaceEngineering:LC05111C13MTTTG
U8 U9 U18 U19 = BrownSpaceEngineering:AD8418: Bidirectional Current Sense Amplifier
U10 U11 = BrownSpaceEngineering:LT1962
U12 U13 = BrownSpaceEngineering:LTC4411
U14 U16 = BrownSpaceEngineering:LTC4121
V1-V36 V40-V51 V53 V99 = BrownSpaceEngineering:VIA

## Net classes
0 default: width 0.254 mm, drill 0.584 mm
1 Digital: width 0.203 mm, drill 0.381 mm
2 Analog: width 0.203 mm, drill 0.381 mm
3 Li-ion: width 2.032 mm, drill 1.905 mm
4 I2C: width 0.254 mm, drill 0.584 mm, clearance 0.508 mm
5 SolarPower: width 1.016 mm, drill 1.27 mm
6 3V3: width 0.381 mm, drill 0.584 mm